# EAGLE design uart-opto-isolation (EAGLE 7.7.0)

## Sheet 1 of 2
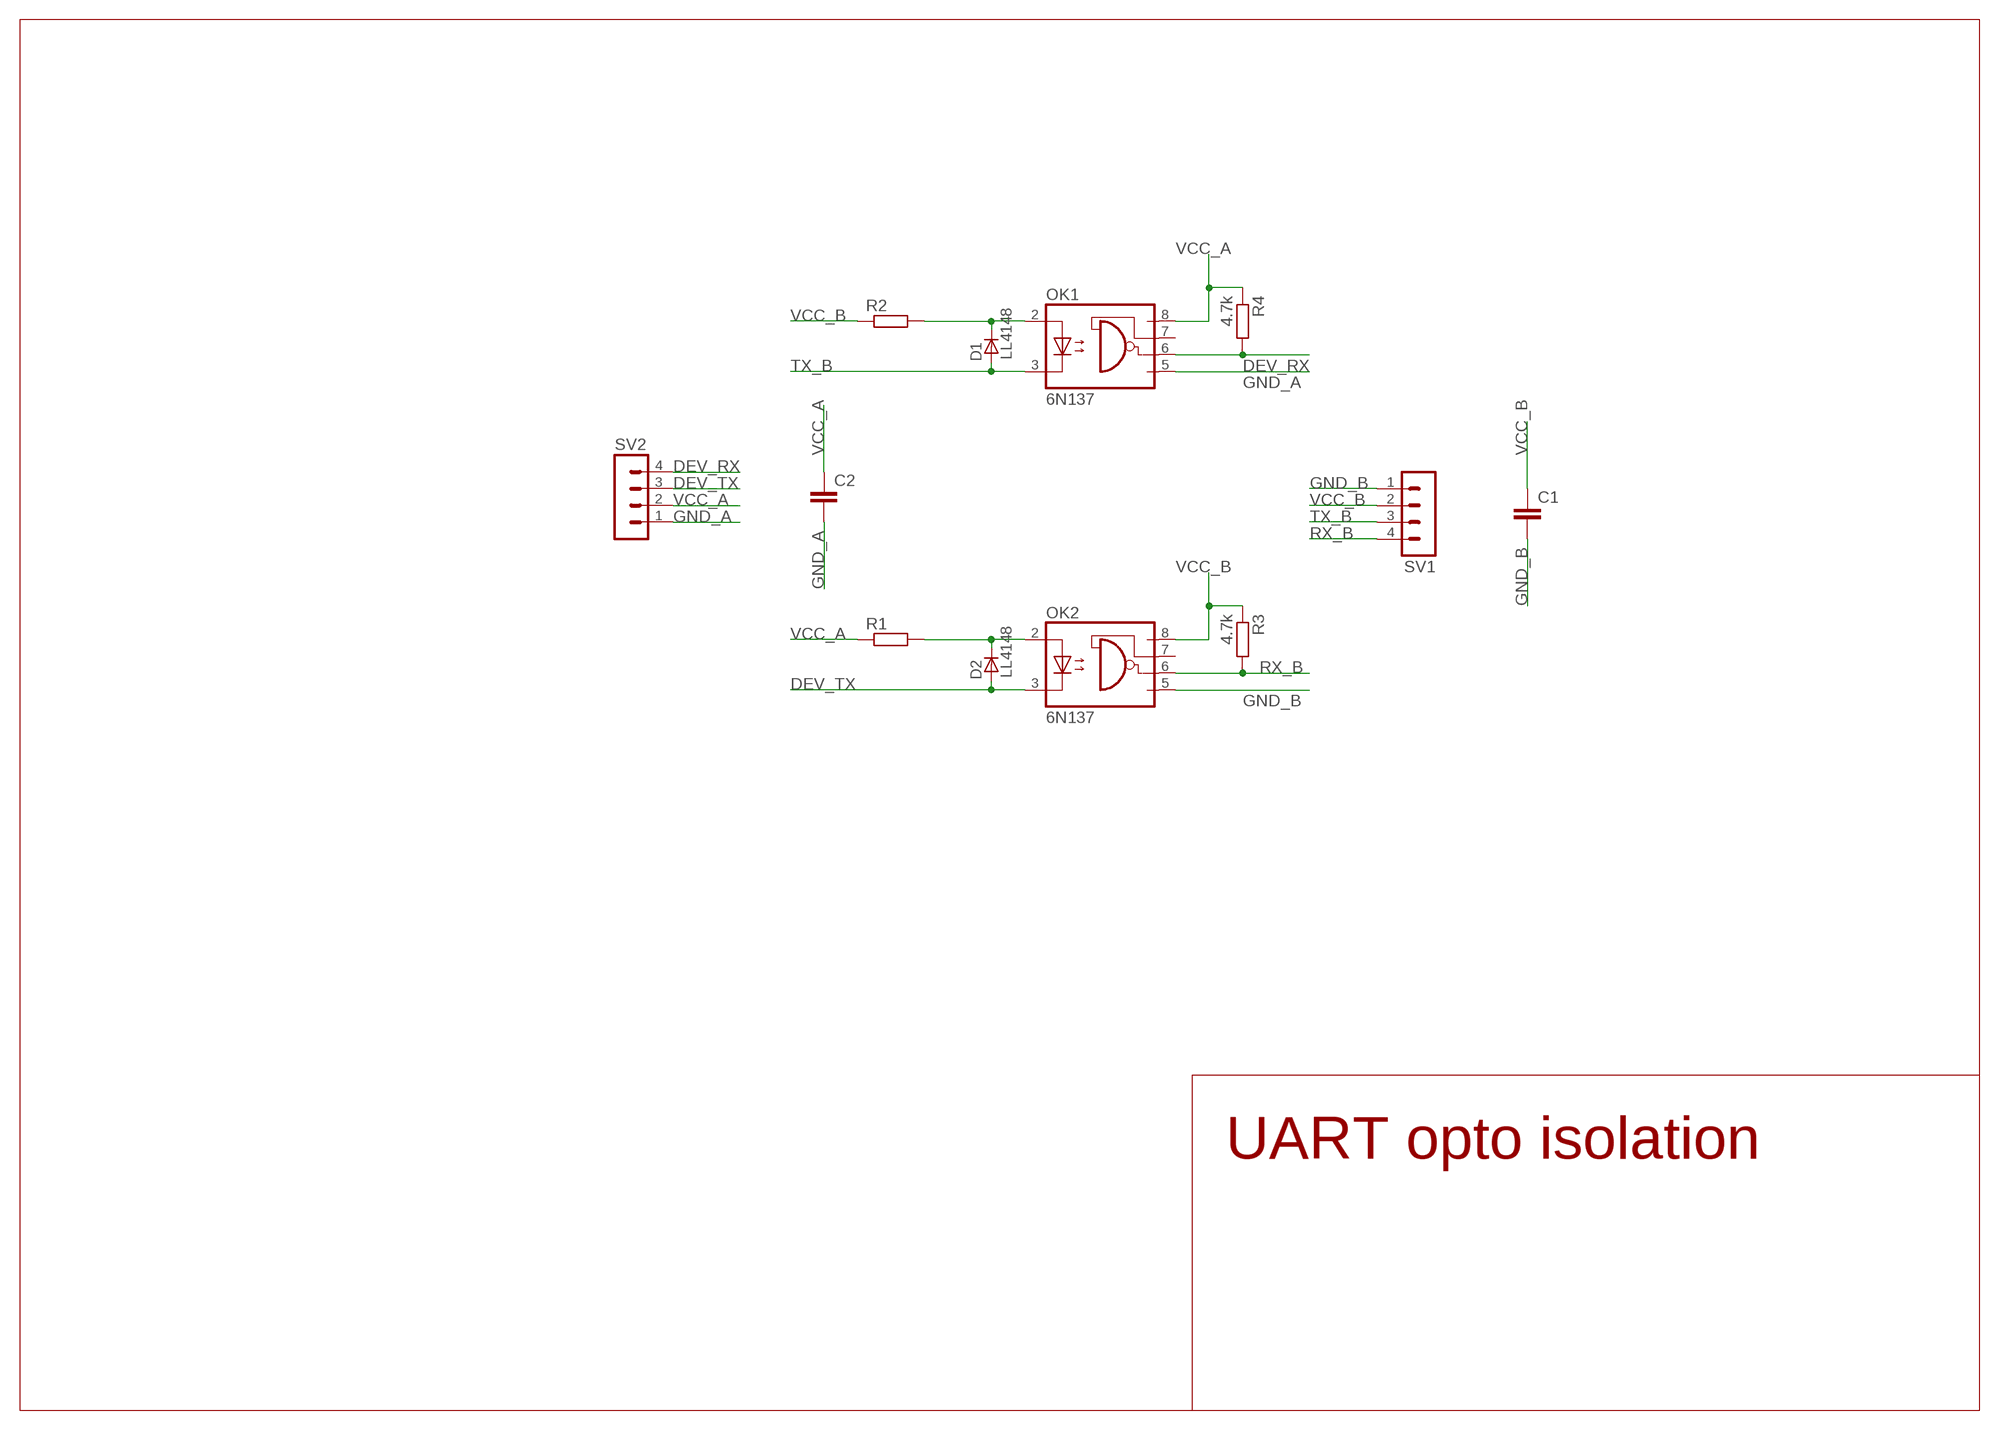
[diagram p0: schematic, sheet 1]

### Parts
C1  C-EUC0805  [C0805]
C2  C-EUC0805  [C0805]
D1  LL4148  [SOD80_DO213AA_MINIMELF]
D2  LL4148  [SOD80_DO213AA_MINIMELF]
OK1  6N137  [DIL08]
OK2  6N137  [DIL08]
R1  R-EU_R0805  [R0805]
R2  R-EU_R0805  [R0805]
R3  4.7k  R-EU_R0805  [R0805]
R4  4.7k  R-EU_R0805  [R0805]
SV1  MA04-1  [MA04-1]
SV2  MA04-1  [MA04-1]

### Nets
DEV_RX: OK1.6(VO) R4.2 SV2.4
DEV_TX: D2.A OK2.3(C) SV2.3
GND_A: C2.2 OK1.5(GND) SV2.1
GND_B: C1.2 OK2.5(GND) SV1.1
N$1: D1.C OK1.2(A) R2.2
N$3: D2.C OK2.2(A) R1.2
RX_B: OK2.6(VO) R3.2 SV1.4
TX_B: D1.A OK1.3(C) SV1.3
VCC_A: C2.1 OK1.8(VCC) R1.1 R4.1 SV2.2
VCC_B: C1.1 OK2.8(VCC) R2.1 R3.1 SV1.2
Unconnected: OK1.7(VE) OK2.7(VE)

### Notes on the sheet
- UART opto isolation

## Sheet 2 of 2
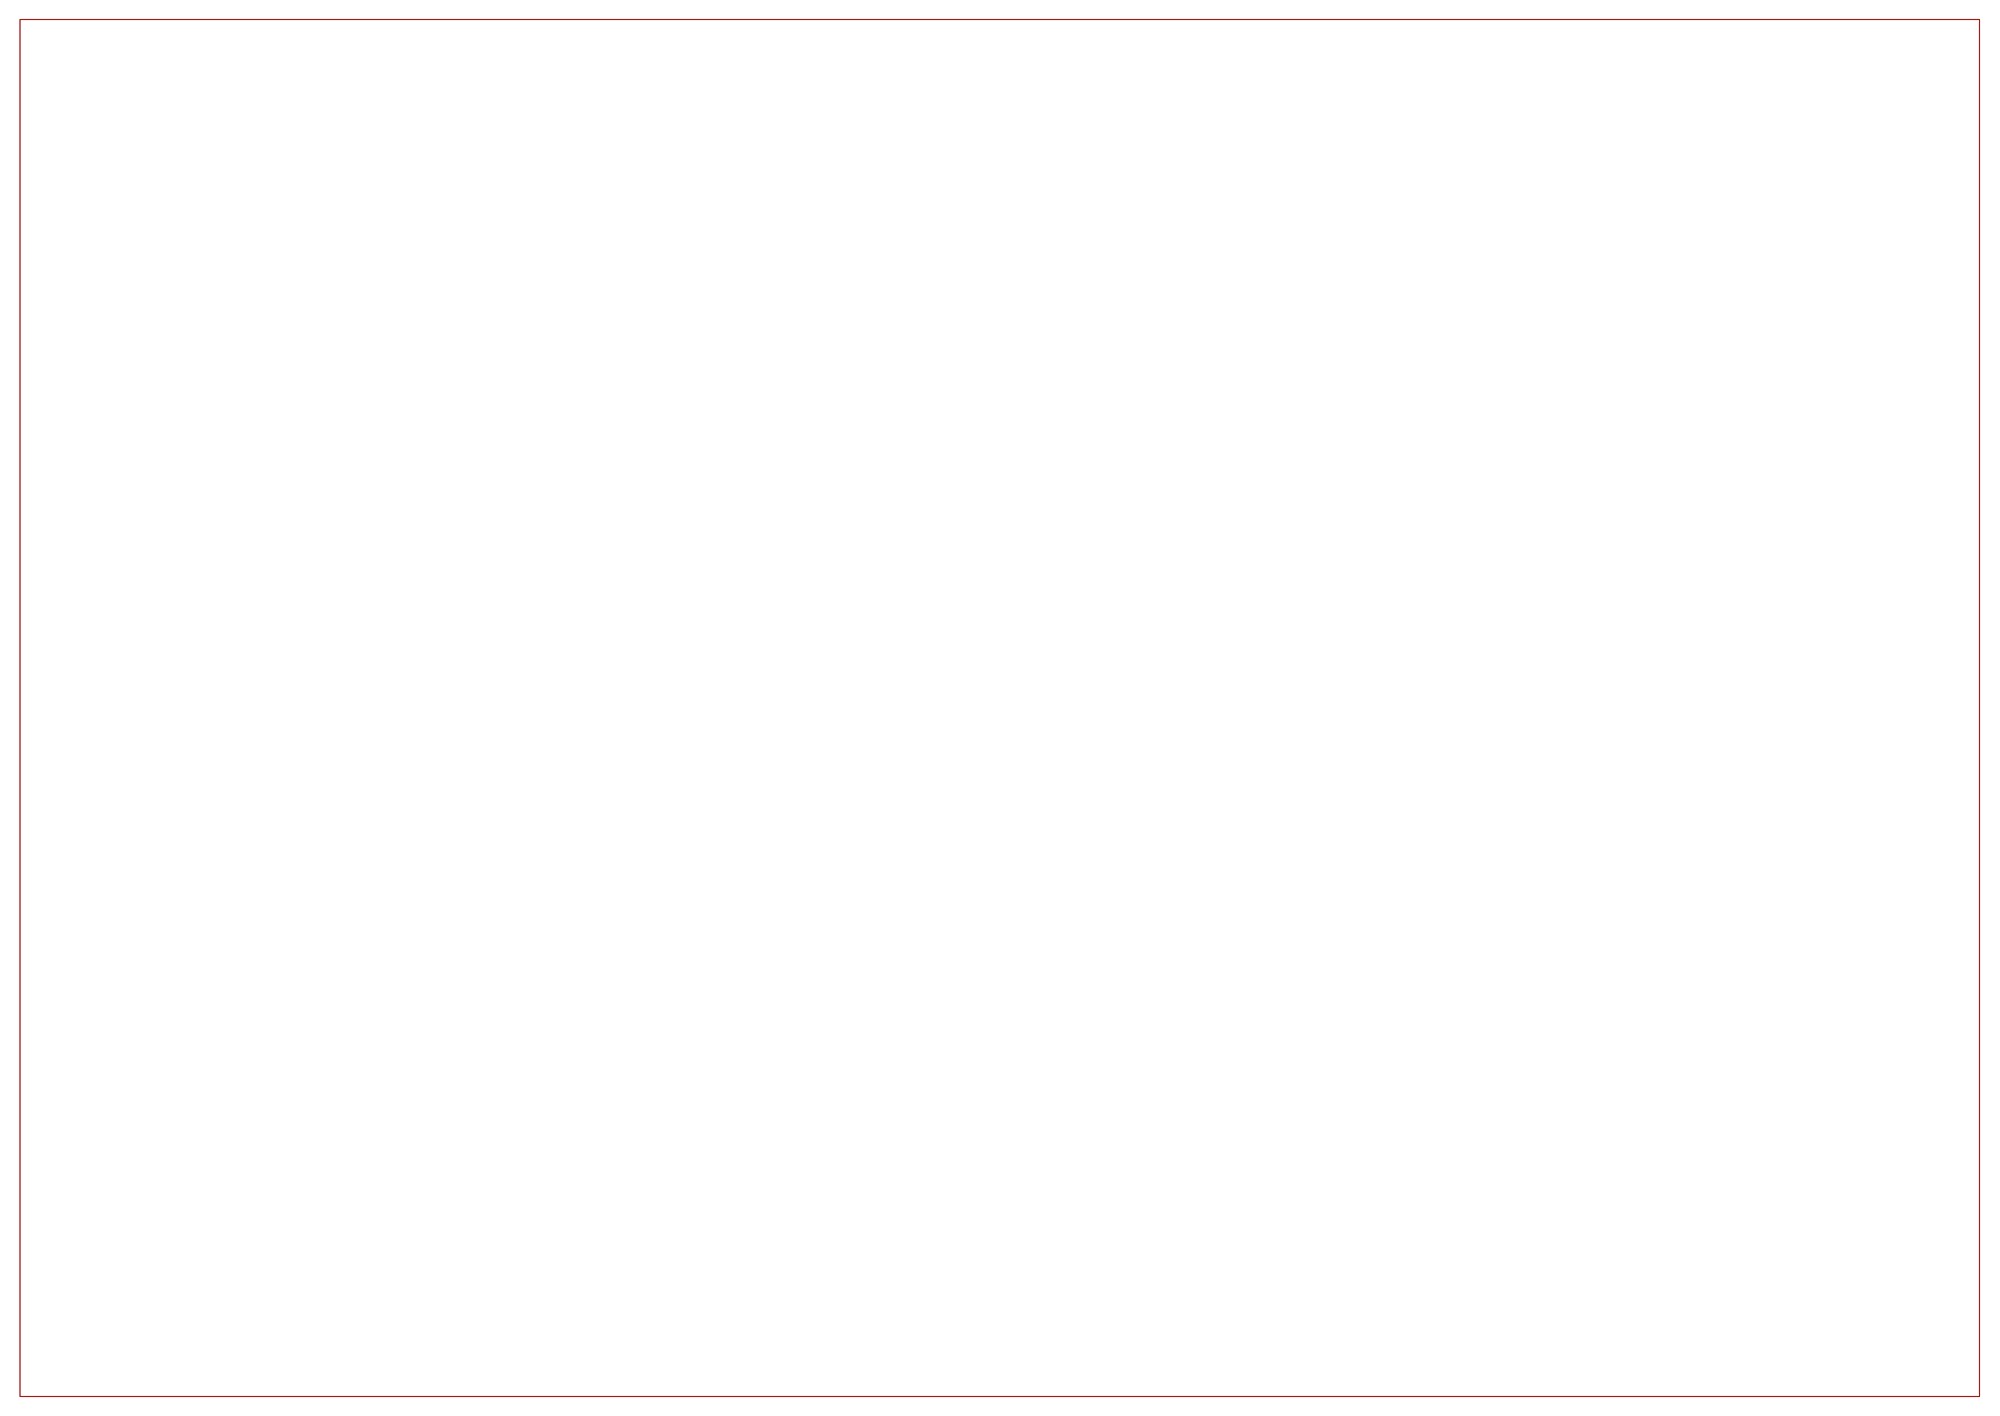
[diagram p1: schematic, sheet 2]

## Library data of the parts
C1 C2 = rcl:C-EU: CAPACITOR, European symbol
D1 D2 = _hhn_diodes_smd:LL4148: 1N4148 General Purpose Rectifie SMD-Version of 1N4148 Case: SOD 80 = DO 213 AA = MINIMELF (Glass) Author: Dipl.-Ing. FH Rainer Bayer HHN Hochschule Heilbronn, rainer.bayer@hs-heilbronn.de Ingenieurbüro ing-rb, mail@ing-rb.de
OK1 OK2 = optocoupler:6N137: MOTOROLA OPTO COUPLER; MPN: 6N137; OC_FARNELL: 1328376; OC_NEWARK: 52M1895
R1-R4 = rcl:R-EU_: RESISTOR, European symbol
SV1 SV2 = con-lstb:MA04-1: PIN HEADER; OC_FARNELL: unknown; OC_NEWARK: unknown

## Board
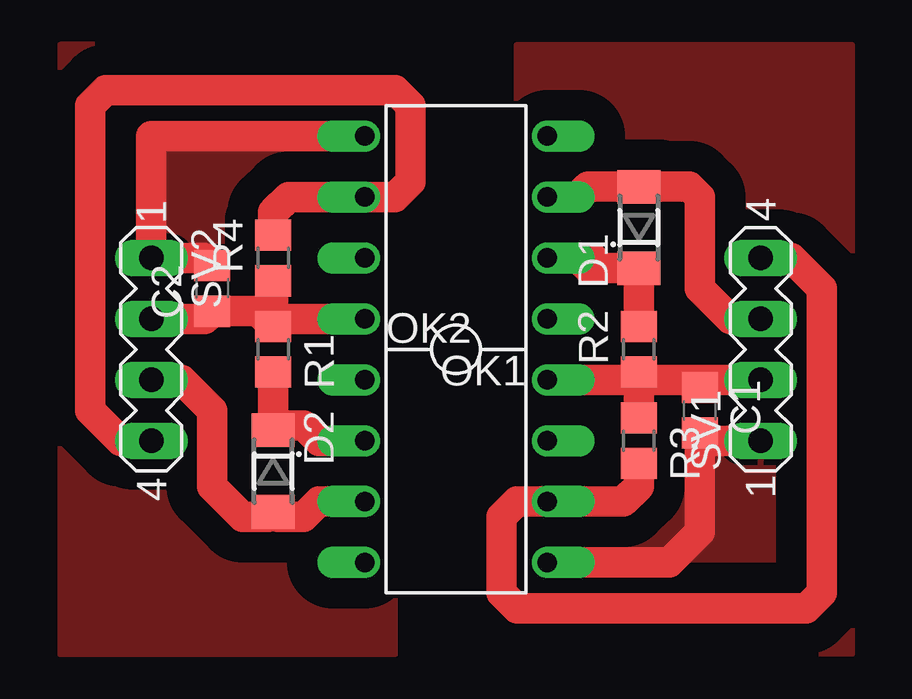
[diagram p2: board, top side]

No outline drawn. Coordinates in mm, seen from the top.
Copper layers (1*16): Top 0.035mm / dielectric 1.5mm / Bottom 0.035mm
Design rules "default": minimum track width 10mil, minimum drill 24mil, track to track 8mil, track to pad 8mil, pad to pad 8mil, via to via 8mil, smd to smd 8mil, copper to edge 40mil, drill to drill 8mil, minimum pad ring 10mil, minimum via ring 8mil, stop-mask expansion 4mil, vias tented up to drill 0mil, thermal gap 10mil

### Footprints (pad centres in the part's own frame; a part is rotated, then mirrored left to right if it is on the bottom)
C0805 = smd 1.3 x 1.5: 1 -0.95,0; 2 0.95,0
SOD80_DO213AA_MINIMELF = smd 1.4 x 1.8: A 1.7,0; C -1.7,0
DIL08 = drill 0.813 offset: 1 -3.81,-3.81; 2 -1.27,-3.81; 3 1.27,-3.81; 4 3.81,-3.81; 5 3.81,3.81; 6 1.27,3.81; 7 -1.27,3.81; 8 -3.81,3.81
R0805 = smd 1.3 x 1.5: 1 -0.95,0; 2 0.95,0
MA04-1 = drill 1.016 long: 1 -3.81,0; 2 -1.27,0; 3 1.27,0; 4 3.81,0

### Placement (x,y rotation side)
C1  26.67,10.16 270 top
C2  6.35,15.24 90 top
D1  24.13,17.78 90 top
D2  8.89,7.62 270 top
OK1  16.51,17.78 90 top
OK2  16.51,7.62 270 top
R1  8.89,12.7 270 top
R2  24.13,12.7 90 top
R3  24.13,8.89 270 top
R4  8.89,16.51 90 top
SV1  29.21,12.7 90 top
SV2  3.81,12.7 270 top

### Tracks (layer width: path | path; a pad name or v marks a point on that pad's centre or on a via)
DEV_RX
  Top 1.27: R4.2 8.89,18.41 9.53,19.05 OK1.6 13.97,19.05 14.61,19.68 14.61,22.86 13.97,23.5 1.91,23.5 1.27,22.86 1.27,10.16 2.54,8.89 SV2.4
DEV_TX
  Top 1.27: OK2.3 10.79,6.35 10.16,5.71 9.1,5.71 D2.A 8.69,5.71 7.62,5.71 6.35,6.99 6.35,10.16 5.08,11.43 SV2.3
GND_A
  Top 1.27: C2.2 6.03,16.51 SV2.1 3.81,21.59 OK1.5
  pour Top (isolate 1.27): 0,0 13.97,0 13.97,25.4 0,25.4
GND_B
  Top 1.27: SV1.1 26.99,8.89 C1.2 26.67,5.08 25.4,3.81 OK2.5
  pour Top (isolate 1.27): 19.05,0 19.05,25.4 33.02,25.4 33.02,0
N$1
  Top 1.27: OK1.2 21.59,16.51 | 21.59,16.51 22.23,16.51 | 21.59,16.51 22.02,16.08 D1.C R2.2
N$3
  Top 1.27: R1.2 D2.C 9.1,9.53 10.16,9.53 10.79,8.89 OK2.2
RX_B
  Top 1.27: R3.2 24.13,6.99 23.5,6.35 OK2.6 19.05,6.35 18.41,5.71 18.41,2.54 19.05,1.91 31.11,1.91 31.75,2.54 31.75,15.24 30.48,16.51 SV1.4
TX_B
  Top 1.27: OK1.3 21.59,19.05 22.02,19.48 D1.A 26.24,19.48 26.67,19.05 26.67,15.24 27.94,13.97 SV1.3
VCC_A
  Top 1.27: SV2.2 6.03,13.97 C2.1 8.25,14.29 R1.1 | R4.1 R1.1 | OK1.8 9.21,13.97 R1.1
VCC_B
  Top 1.27: R3.1 R2.1 | OK2.8 23.81,11.43 R2.1 | C1.1 26.67,11.43 | 26.67,11.43 24.45,11.43 R2.1 | SV1.2 26.67,11.43